# EasyEDA Pro project ProPrj_承载我所有幻想的键盘_2025-02-09.epro, schematic 08-Schematic
Create Date: 2024-07-30; Page Name: P1; Project Name: 承载我所有幻想的键盘; Schematic Name: Schematic1; Update Date: 2024-07-30
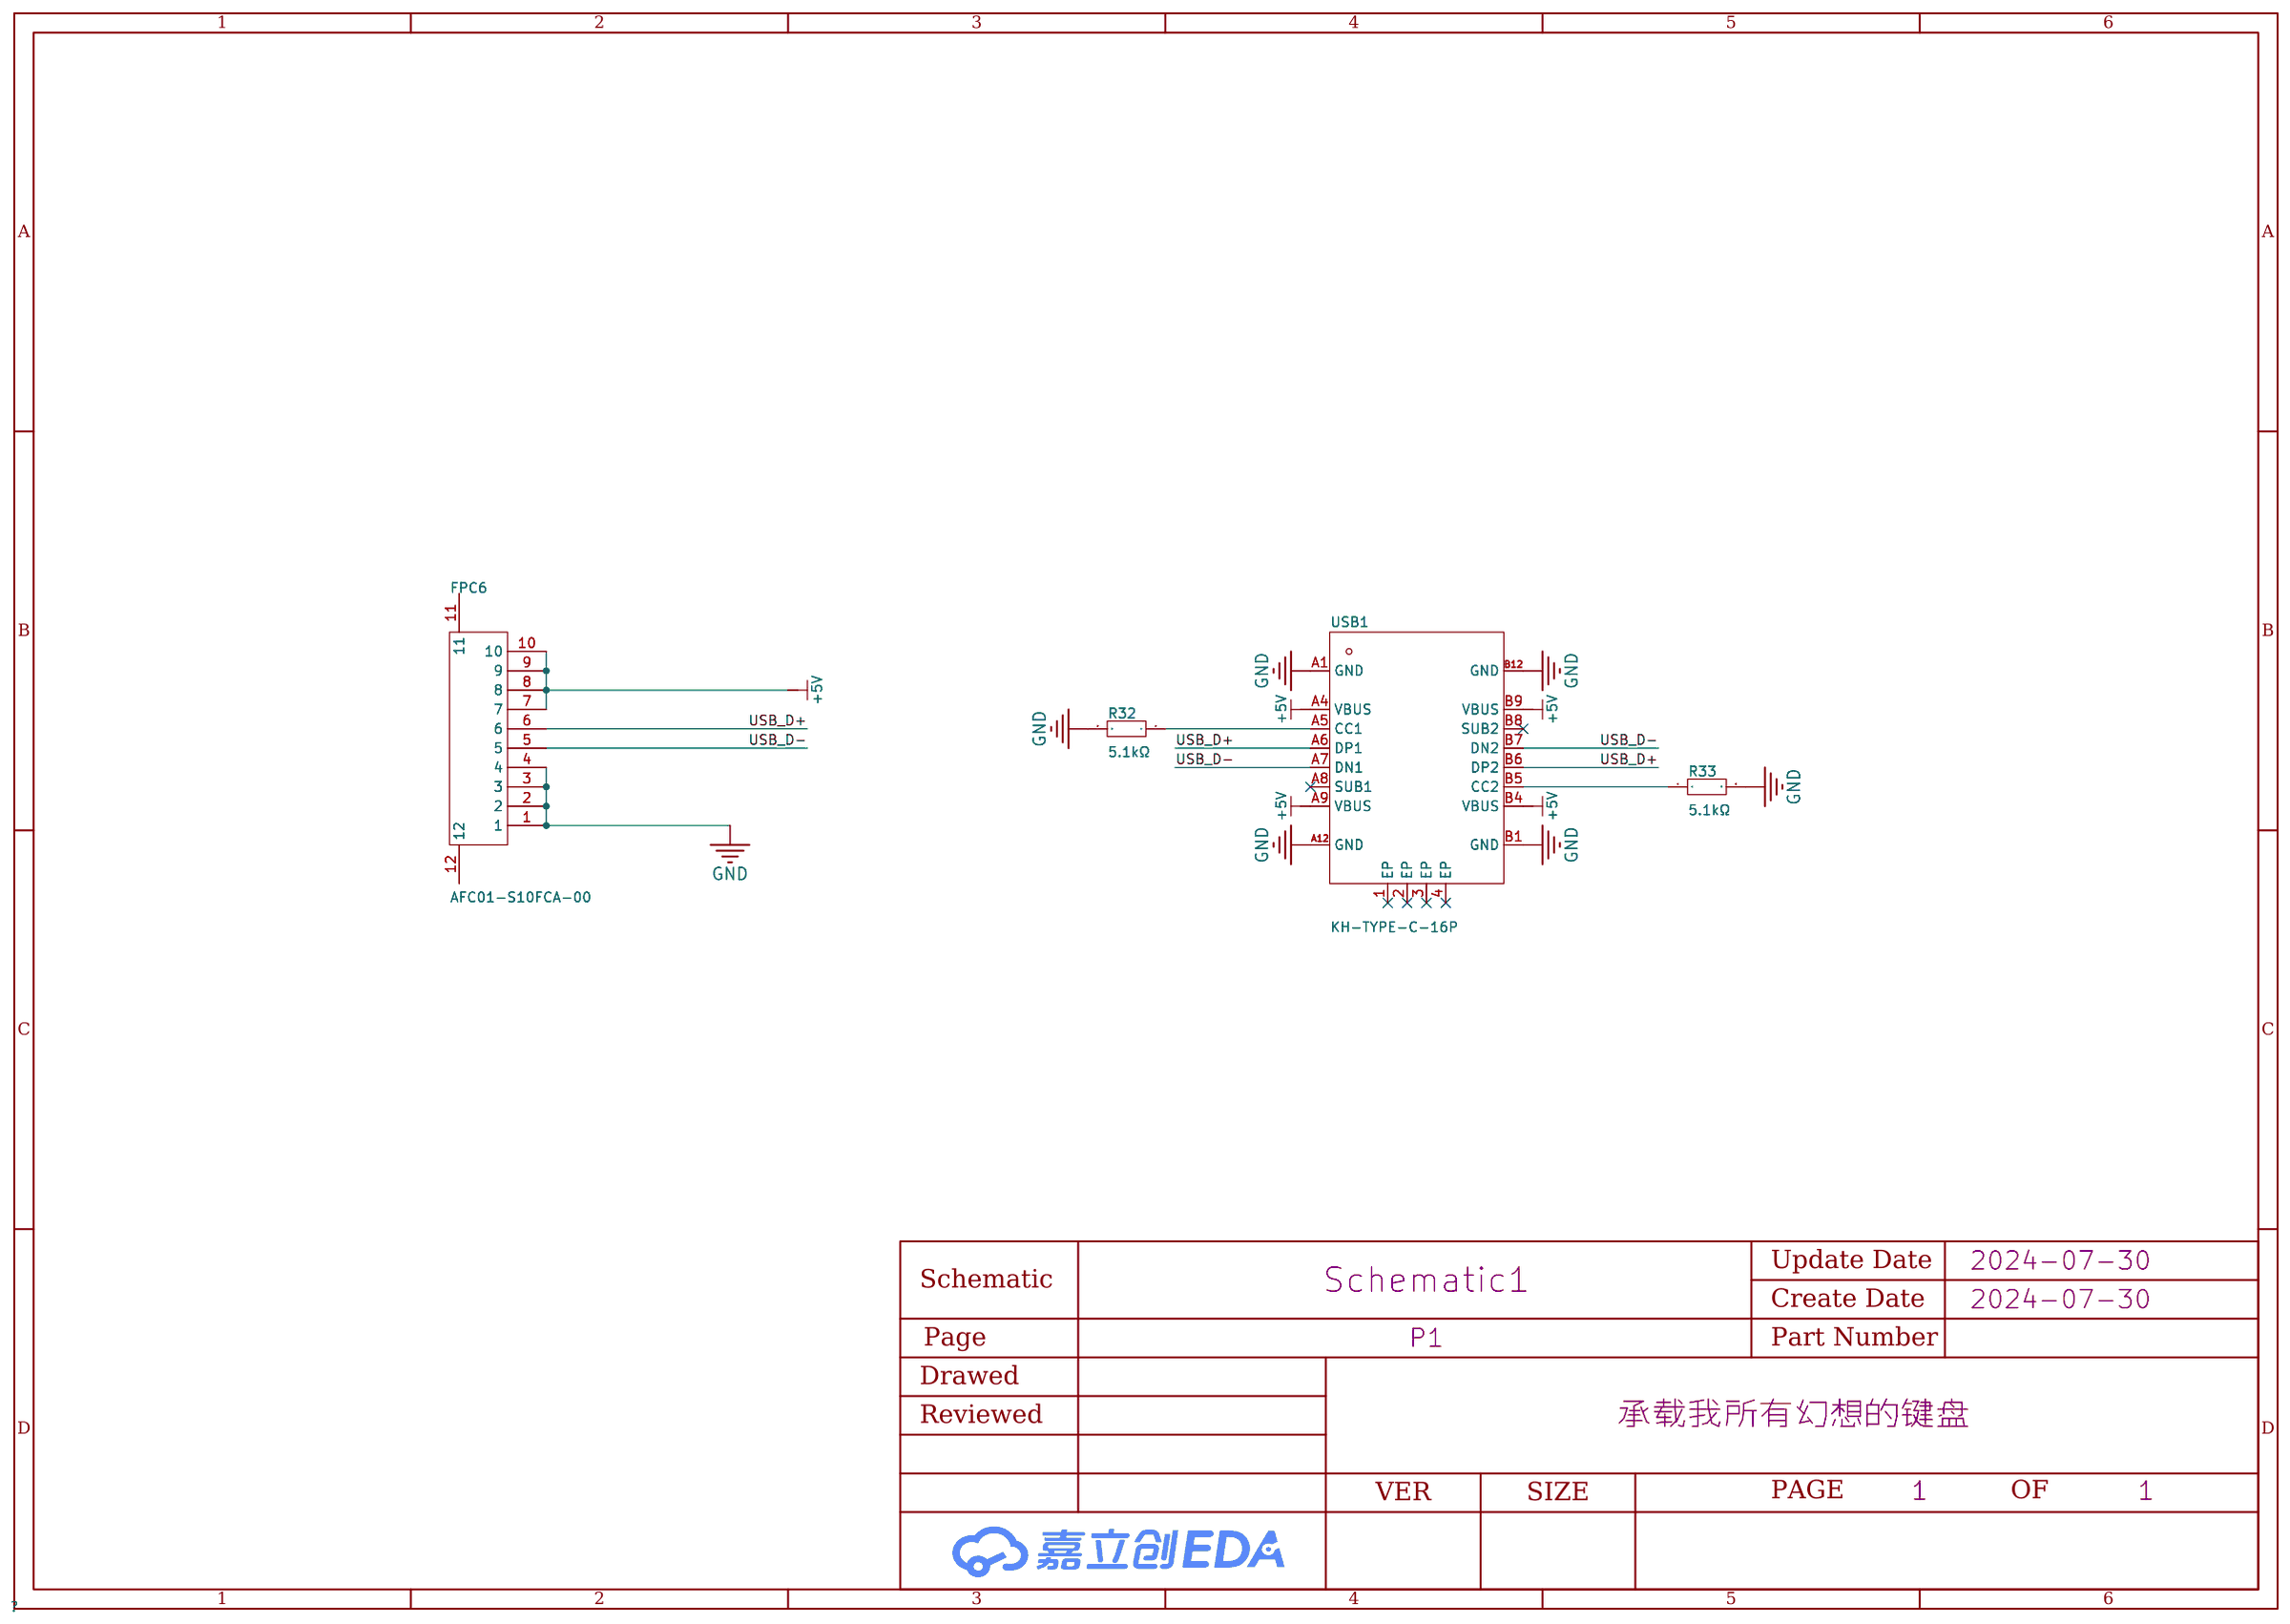
[diagram p15: schematic sheet]

## Parts
FPC6  AFC01-S10FCA-00  [FPC-SMD_P0.5-10P_FGS-XJ-H2.0]
R32  5.1kΩ  [R0402]
R33  5.1kΩ  [R0402]
USB1  KH-TYPE-C-16P  [USB-C-SMD_KH-TYPE-C-16P]

## Library data of the parts
FPC6 = AFC01-S10FCA-00: 锁定特性:翻盖式;触点类型:下接;触点数量:10P;间距:0.5mm;安装类型:卧贴;; LCSC Part Name: 间距:0.5mm P数:10P 翻盖式 下接; Supplier Part: C262659; Manufacturer: JS(钜硕电子); Supplier Footprint: SMD,P=0.5mm,卧贴; JLCPCB Part Class: 扩展库; Datasheet: https://atta.szlcsc.com/upload/public/pdf/source/20190816/C413942_2A72D1AC756EAE17EEDF756A339D4500.pdf; Supplier: LCSC; Locking Feature: 翻盖式; Contact Type: 下接; Number of Contacts: 10P; Pitch: 0.5mm; Mounting Type: 卧贴; FFC, FCB Thickness: 0.3mm; Height Above Board: 2mm
R32 R33 = RMC04025.1K1%N: 阻值:5.1kΩ;精度:±1%;功率:62.5mW;; LCSC Part Name: 5.1kΩ ±1% 62.5mW; Supplier Part: C325521; Manufacturer: Tyohm(幸亚电阻); Supplier Footprint: 0402; JLCPCB Part Class: 扩展库; Datasheet: https://atta.szlcsc.com/upload/public/pdf/source/20190115/C325521_1EC5F156994D781C7E2B08432302F19F.pdf; Supplier: LCSC; Tolerance: ±1%; Power(Watts): 62.5mW
USB1 = KH-TYPE-C-16P: 连接器类型:Type-C;标准:-;公母:母座;触点数量:16;端口数量:1;安装方式:卧贴;额定电流 - 电源:3A;工作温度范围:-40~+85;; LCSC Part Name: Type-C 母座 卧贴; Supplier Part: C709357; Manufacturer: kinghelm(金航标); Supplier Footprint: SMD; JLCPCB Part Class: 扩展库; Datasheet: https://atta.szlcsc.com/upload/public/pdf/source/20200911/C709357_AA8DCEB38BB20E3035A7ED7AE7667837.pdf; Supplier: LCSC; Connector Type: Type-C; Gender: 母座; Number of Contacts: 16; Number of Ports: 1; Mounting Style: 卧贴; Current Rating - Power (Max): 3A; Operating Temperature Range: -40~+85

## Nets
+5V: FPC6.7 FPC6.8 FPC6.9 FPC6.10 USB1.A4(VBUS) USB1.A9(VBUS) USB1.B4(VBUS) USB1.B9(VBUS)
GND: FPC6.1 FPC6.2 FPC6.3 FPC6.4 R32.2 R33.2 USB1.A1(GND) USB1.A12(GND) USB1.B1(GND) USB1.B12(GND)
USB_D+: FPC6.6 USB1.A6(DP1) USB1.B6(DP2)
USB_D-: FPC6.5 USB1.A7(DN1) USB1.B7(DN2)
$1N771: R32.1 USB1.A5(CC1)
$1N776: R33.1 USB1.B5(CC2)

Not connected (* = marked no-connect by the designer): FPC6 11 12; USB1 1(EP)* 2(EP)* 3(EP)* 4(EP)* A8(SUB1)* B8(SUB2)*
